# Altium schematic sheet 5others_OCT1.SchDoc
size 297 x 209 mm
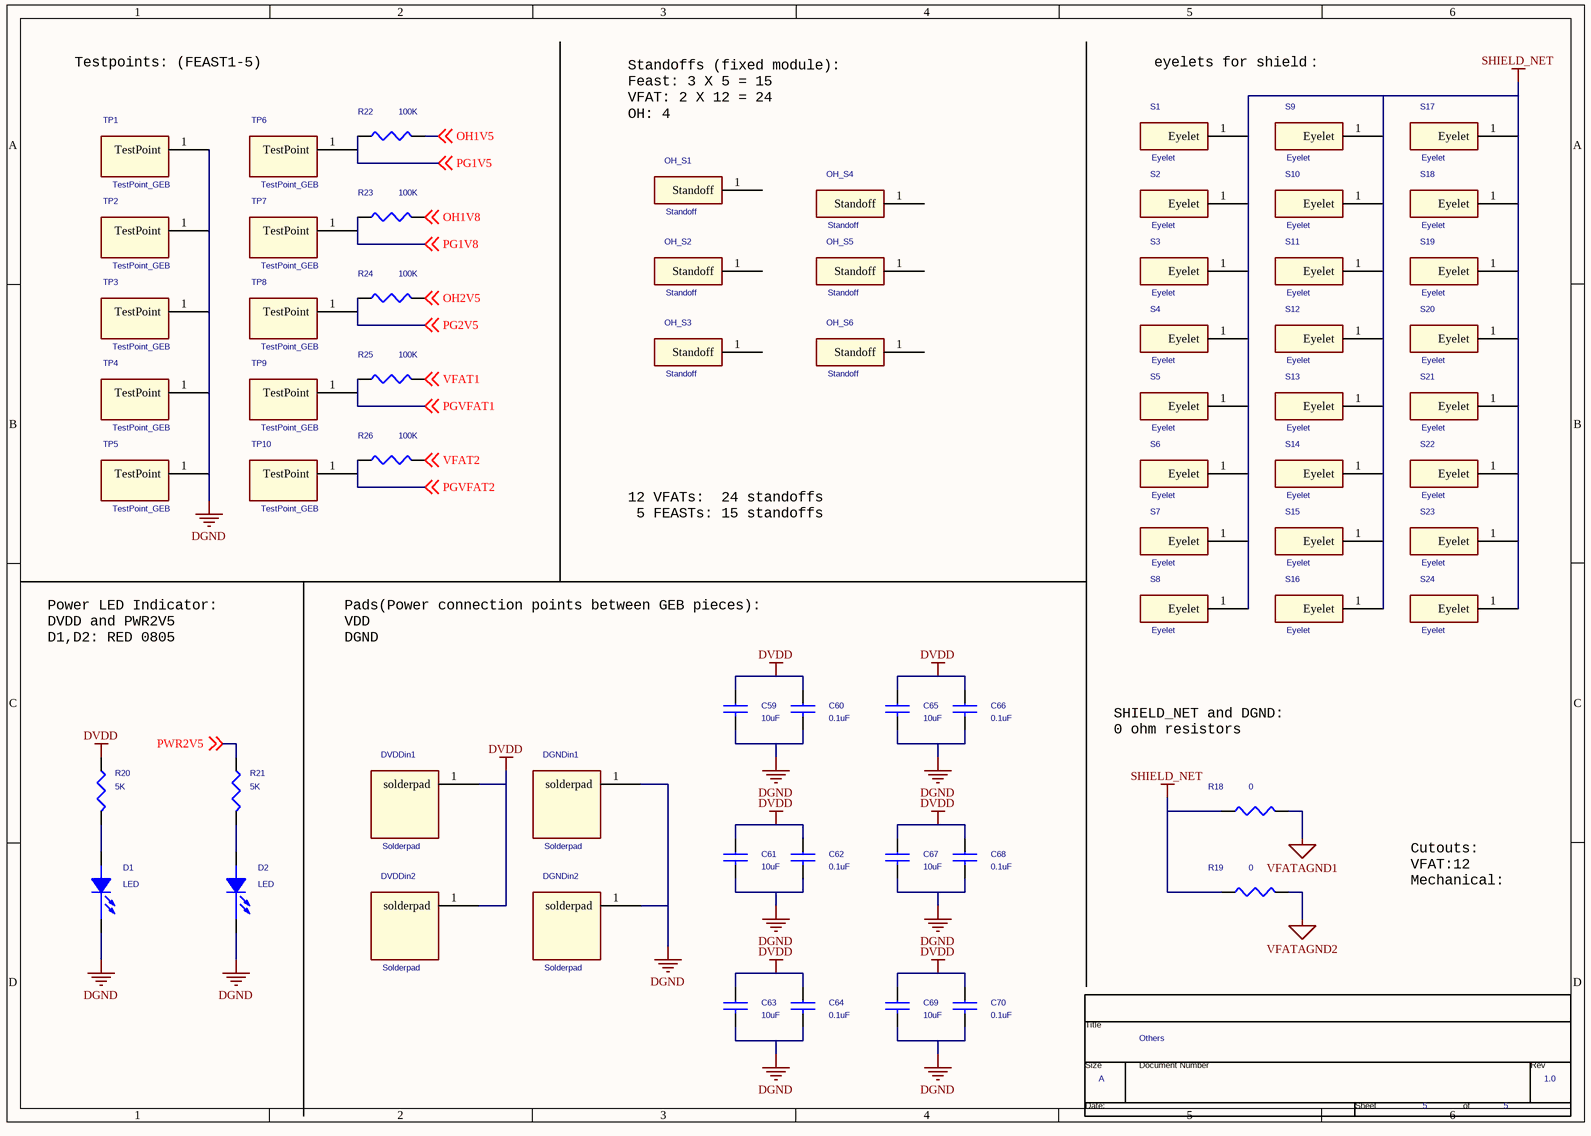
[diagram p0: 5others_OCT1.SchDoc]

## Parts
*  Page Count: 5  Page Size: A  Title: Others  RevCode: 1.0  (hidden comment: TitleBlock0)  (graphical)
C59  10uF  [C1206]
C60  0.1uF  [C0603]
C61  10uF  [C1206]
C62  0.1uF  [C0603]
C63  10uF  [C1206]
C64  0.1uF  [C0603]
C65  10uF  [C1206]
C66  0.1uF  [C0603]
C67  10uF  [C1206]
C68  0.1uF  [C0603]
C69  10uF  [C1206]
C70  0.1uF  [C0603]
D1  LED  [L0805]
D2  LED  [L0805]
DGNDin1  Solderpad  [Solderpad]
DGNDin2  Solderpad  [Solderpad]
DVDDin1  Solderpad  [Solderpad]
DVDDin2  Solderpad  [Solderpad]
OH_S1  Standoff  [S_GEB]
OH_S2  Standoff  [S_GEB]
OH_S3  Standoff  [S_GEB]
OH_S4  Standoff  [S_GEB]
OH_S5  Standoff  [S_GEB]
OH_S6  Standoff  [S_GEB]
R18  0  [R1206]
R19  0  [R1206]
R20  5K  [R0603]
R21  5K  [R0603]
R22  100K  [R0603]
R23  100K  [R0603]
R24  100K  [R0603]
R25  100K  [R0603]
R26  100K  [R0603]
S1  Eyelet  [S_GEB]
S2  Eyelet  [S_GEB]
S3  Eyelet  [S_GEB]
S4  Eyelet  [S_GEB]
S5  Eyelet  [S_GEB]
S6  Eyelet  [S_GEB]
S7  Eyelet  [S_GEB]
S8  Eyelet  [S_GEB]
S9  Eyelet  [S_GEB]
S10  Eyelet  [S_GEB]
S11  Eyelet  [S_GEB]
S12  Eyelet  [S_GEB]
S13  Eyelet  [S_GEB]
S14  Eyelet  [S_GEB]
S15  Eyelet  [S_GEB]
S16  Eyelet  [S_GEB]
S17  Eyelet  [S_GEB]
S18  Eyelet  [S_GEB]
S19  Eyelet  [S_GEB]
S20  Eyelet  [S_GEB]
S21  Eyelet  [S_GEB]
S22  Eyelet  [S_GEB]
S23  Eyelet  [S_GEB]
S24  Eyelet  [S_GEB]
TP1  TestPoint_GEB  [TP_GEB]
TP2  TestPoint_GEB  [TP_GEB]
TP3  TestPoint_GEB  [TP_GEB]
TP4  TestPoint_GEB  [TP_GEB]
TP5  TestPoint_GEB  [TP_GEB]
TP6  TestPoint_GEB  [TP_GEB]
TP7  TestPoint_GEB  [TP_GEB]
TP8  TestPoint_GEB  [TP_GEB]
TP9  TestPoint_GEB  [TP_GEB]
TP10  TestPoint_GEB  [TP_GEB]

## Nets
DGND: C59.2 C60.2 C61.2 C62.2 C63.2 C64.2 C65.2 C66.2 C67.2 C68.2 C69.2 C70.2 D1.1(CATHODE) D2.1(CATHODE) DGNDin1.1(solderpad) DGNDin2.1(solderpad) TP1.1(TestPoint) TP2.1(TestPoint) TP3.1(TestPoint) TP4.1(TestPoint) TP5.1(TestPoint)
DVDD: C59.1 C60.1 C61.1 C62.1 C63.1 C64.1 C65.1 C66.1 C67.1 C68.1 C69.1 C70.1 DVDDin1.1(solderpad) DVDDin2.1(solderpad) R20.1
SHIELD_NET: R18.1 R19.1 S1.1(Eyelet) S2.1(Eyelet) S3.1(Eyelet) S4.1(Eyelet) S5.1(Eyelet) S6.1(Eyelet) S7.1(Eyelet) S8.1(Eyelet) S9.1(Eyelet) S10.1(Eyelet) S11.1(Eyelet) S12.1(Eyelet) S13.1(Eyelet) S14.1(Eyelet) S15.1(Eyelet) S16.1(Eyelet) S17.1(Eyelet) S18.1(Eyelet) S19.1(Eyelet) S20.1(Eyelet) S21.1(Eyelet) S22.1(Eyelet) S23.1(Eyelet) S24.1(Eyelet)
VFATAGND1: R18.2
VFATAGND2: R19.2
OH1V5: R22.2 ; off-sheet OH1V5
OH1V8: R23.2 ; off-sheet OH1V8
OH2V5: R24.2 ; off-sheet OH2V5
PG1V5: R22.1 TP6.1(TestPoint) ; off-sheet PG1V5
PG1V8: R23.1 TP7.1(TestPoint) ; off-sheet PG1V8
PG2V5: R24.1 TP8.1(TestPoint) ; off-sheet PG2V5
PGVFAT1: R25.1 TP9.1(TestPoint) ; off-sheet PGVFAT1
PGVFAT2: R26.1 TP10.1(TestPoint) ; off-sheet PGVFAT2
PWR2V5: R21.1 ; off-sheet PWR2V5
VFAT1: R25.2 ; off-sheet VFAT1
VFAT2: R26.2 ; off-sheet VFAT2
NetD1_2: D1.2(ANODE) R20.2
NetD2_2: D2.2(ANODE) R21.2

Not connected (* = marked no-connect by the designer): OH_S1 1(Standoff); OH_S2 1(Standoff); OH_S3 1(Standoff); OH_S4 1(Standoff); OH_S5 1(Standoff); OH_S6 1(Standoff)

## Notes on the sheet
- Testpoints: (FEAST1-5)
- Standoffs (fixed module):
  Feast: 3 X 5 = 15
  VFAT: 2 X 12 = 24
  OH: 4
- eyelets for shield：
- 12 VFATs:  24 standoffs
  5 FEASTs: 15 standoffs
- Power LED Indicator:
  DVDD and PWR2V5
  D1,D2: RED 0805
- Pads(Power connection points between GEB pieces):
  VDD
  DGND
- SHIELD_NET and DGND:
  0 ohm resistors
- Cutouts:
  VFAT:12
  Mechanical:
- (in symbol TitleBlock0) Title; Size; Document Number; Rev; Date:; Sheet; of

## Library data of the parts
C59-C70 = CAP NP
R18 R19 = R_Dup1
R20-R26 = R
* = TitleBlock0: Page Number: 5; Page Create Date: March  8, 1995